# Altium schematic sheet DC-DC regulator.SchDoc
size 539 x 193 mm; SheetNumber: 1; SheetTotal: 1
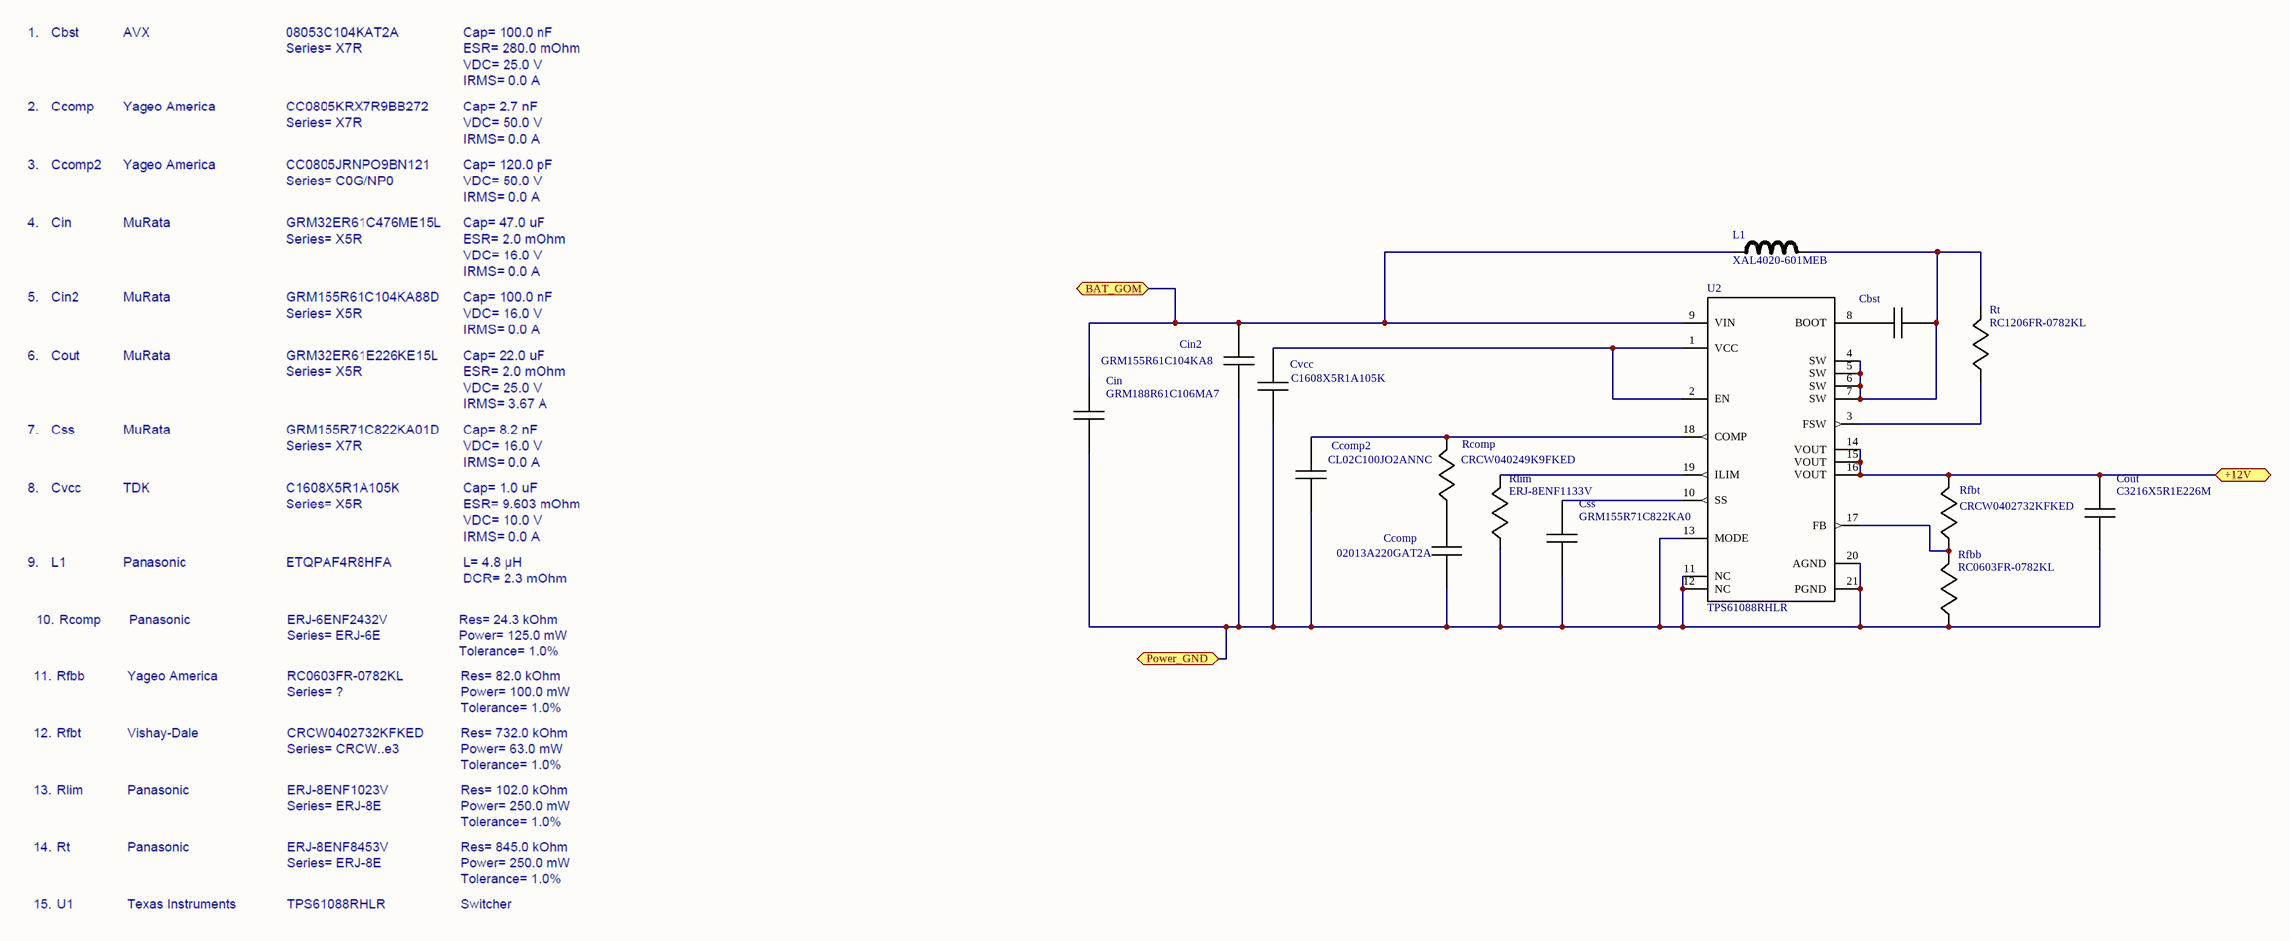
[diagram p0: DC-DC regulator.SchDoc]

## Parts
Cbst  C1005X5R1A104K  [1005]  (value not drawn)
Ccomp  02013A220GAT2A  [0201]
Ccomp2  CL02C100JO2ANNC  [01005]
Cin  GRM188R61C106MA7  [0603]
Cin2  GRM155R61C104KA8  [0402]
Cout  C3216X5R1E226M  [1206]
Css  GRM155R71C822KA0  [0402]
Cvcc  C1608X5R1A105K  [1608]
L1  XAL4020-601MEB  [XAL4020]
Rcomp  CRCW040249K9FKED  [0402]
Rfbb  RC0603FR-0782KL  [0603]
Rfbt  CRCW0402732KFKED  [0402]
Rlim  ERJ-8ENF1133V  [1206]
Rt  RC1206FR-0782KL  [1206]
U2  TPS61088RHLR  [RHL0020A]

## Ports
+12V (bidir), BAT_GOM (bidir), Power_GND (bidir)

## Nets
+12V: Cout.1 Rfbt.1 U2.14(VOUT) U2.15(VOUT) U2.16(VOUT) ; port +12V
BAT_GOM: Cin.1 Cin2.1 L1.1 U2.9(VIN) ; port BAT_GOM
Power_GND: Ccomp.2 Ccomp2.1 Cin.2 Cin2.2 Cout.2 Css.1 Cvcc.1 Rfbb.2 Rlim.2 U2.11(NC) U2.12(NC) U2.13(MODE) U2.20(AGND) U2.21(PGND) ; port Power_GND
NetCbst_1: Cbst.1 L1.2 Rt.1 U2.4(SW) U2.5(SW) U2.6(SW) U2.7(SW)
NetCbst_2: Cbst.2 U2.8(BOOT)
NetCcomp2_2: Ccomp2.2 Rcomp.1 U2.18(COMP)
NetCcomp_1: Ccomp.1 Rcomp.2
NetCss_2: Css.2 U2.10(SS)
NetCvcc_2: Cvcc.2 U2.1(VCC) U2.2(EN)
NetRfbb_1: Rfbb.1 Rfbt.2 U2.17(FB)
NetRlim_1: Rlim.1 U2.19(ILIM)
NetRt_2: Rt.2 U2.3(FSW)

## Library data of the parts
Cbst = C1005X5R1A104K: Imported; Vendor: TDK; Value: 100nF; Manufacturer_Part_Number: C1005X5R1A104K; RefDes: RefDes; TYPE: TYPE
Ccomp = 02013A220GAT2A: Imported; Vendor: AVX; Manufacturer_Part_Number: 02013A220GAT2A; RefDes: RefDes; TYPE: TYPE; Value: Value
Ccomp2 = CL02C100JO2ANNC: Imported; Vendor: Samsung Electro-Mechanics; Manufacturer_Part_Number: CL02C100JO2ANNC; RefDes: RefDes; TYPE: TYPE; Value: Value
Cin = GRM188R61C106MA7: Imported; Manufacturer_Part_Number: GRM188R61C106MA73D; Cap: 1.0E-5; ESR: 0; VDC: 16; Vendor: Murata; IRMS: 0; RefDes: RefDes; TYPE: TYPE; Value: Value
Cin2 = GRM155R61C104KA8: Imported; Manufacturer_Part_Number: GRM155R61C104KA88D; Vendor: MuRata; RefDes: RefDes; TYPE: TYPE; Value: Value
Cout = C3216X5R1E226M: Imported; Vendor: TDK; Manufacturer_Part_Number: C3216X5R1E226M; RefDes: RefDes; TYPE: TYPE; Value: Value
Css = GRM155R71C822KA0: Imported; Manufacturer_Part_Number: GRM155R71C822KA01D; Vendor: MuRata; RefDes: RefDes; TYPE: TYPE; Value: Value
Cvcc = C1608X5R1A105K: Imported; Vendor: TDK; Manufacturer_Part_Number: C1608X5R1A105K; RefDes: RefDes; TYPE: TYPE; Value: Value
L1 = XAL4020-601MEB: Imported; Vendor: Coilcraft; Manufacturer_Part_Number: XAL4020-601MEB; RefDes: RefDes; TYPE: TYPE; Value: Value
Rcomp = CRCW040249K9FKED: Imported; Res_ohm: 49900; Power_W: 0.063; PartNumber: CRCW040249K9FKED; RefDes: RefDes; TYPE: TYPE; Value: Value
Rfbb = RC0603FR-0782KL: Imported; Vendor: Yageo America; Manufacturer_Part_Number: RC0603FR-0782KL; RefDes: RefDes; TYPE: TYPE; Value: Value
Rfbt = CRCW0402732KFKED: Imported; Vendor: Vishay-Dale; Manufacturer_Part_Number: CRCW0402732KFKED; RefDes: RefDes; TYPE: TYPE; Value: Value
Rlim = ERJ-8ENF1133V: Imported; Vendor: Panasonic; Manufacturer_Part_Number: ERJ-8ENF1133V; RefDes: RefDes; TYPE: TYPE; Value: Value
Rt = RC1206FR-0782KL: Imported; Vendor: Yageo America; Manufacturer_Part_Number: RC1206FR-0782KL; RefDes: RefDes; TYPE: TYPE; Value: Value
U2 = TPS61088RHLR: Imported; Alternate PartNumber: TPS61088RHLT; Manufacturer: Texas Instruments; CompType: IC; PIN_COUNT: 21; Application_BuildNumber: *; PartNumber: TPS61088RHLR; PackageReference: RHL0020A; MountType: SMT; RoHS: Y; RefDes: RefDes; TYPE: TYPE; Value: Value; Manufacturer_Part_Number: TPS61088RHLR; Manufacturer_Name: Texas Instruments